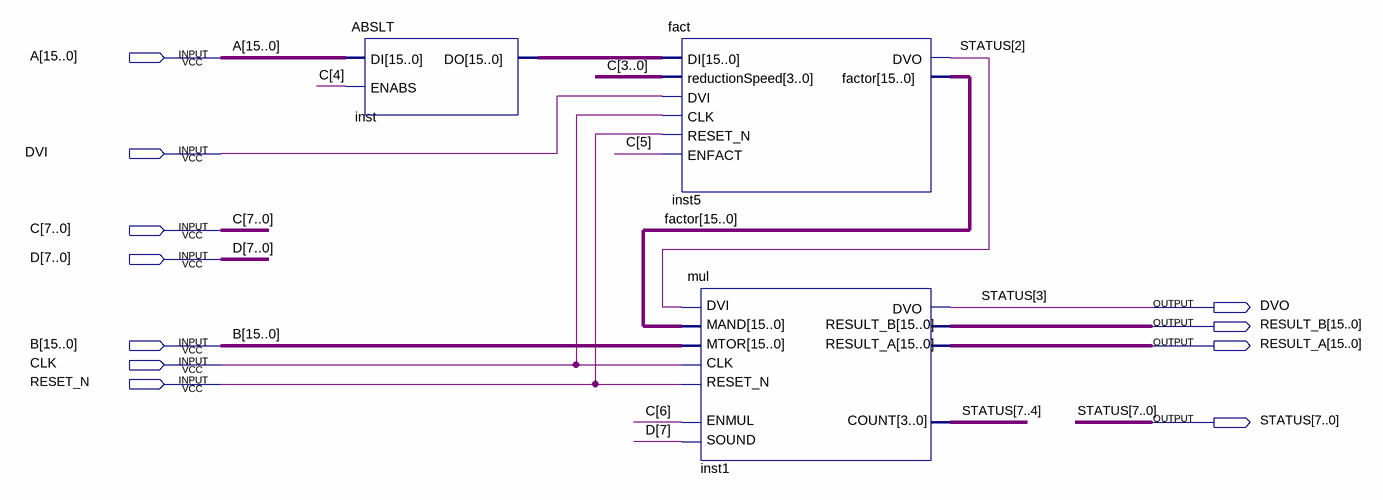
[diagram p0: schematic sheet]
// Quartus schematic StudentDesign.bdf as structural Verilog: 3 symbols, 11 pins
module StudentDesign (
  input  [15:0] A,
  input  DVI,
  input  [7:0] C,
  input  [7:0] D,
  input  [15:0] B,
  input  CLK,
  input  RESET_N,
  output DVO,
  output [15:0] RESULT_B,
  output [15:0] RESULT_A,
  output [7:0] STATUS
);

  wire [15:0] factor, inst_do;

  ABSLT inst (.ENABS(C[4]), .DI(A), .DO(inst_do));
  fact inst5 (
    .reductionSpeed(C[3:0]), .DI(inst_do), .DVI(DVI), .CLK(CLK), .RESET_N(RESET_N), .ENFACT(C[5]),
    .DVO(STATUS[2]), .factor(factor));
  mul inst1 (
    .DVI(STATUS[2]), .MTOR(B), .CLK(CLK), .RESET_N(RESET_N), .MAND(factor), .ENMUL(C[6]), .SOUND(D[7]),
    .DVO(DVO), .COUNT(STATUS[7:4]), .RESULT_B(RESULT_B), .RESULT_A(RESULT_A));

  assign STATUS[3] = DVO;
endmodule
